# EAGLE design AB_ESP8266 (EAGLE 6.6.0)
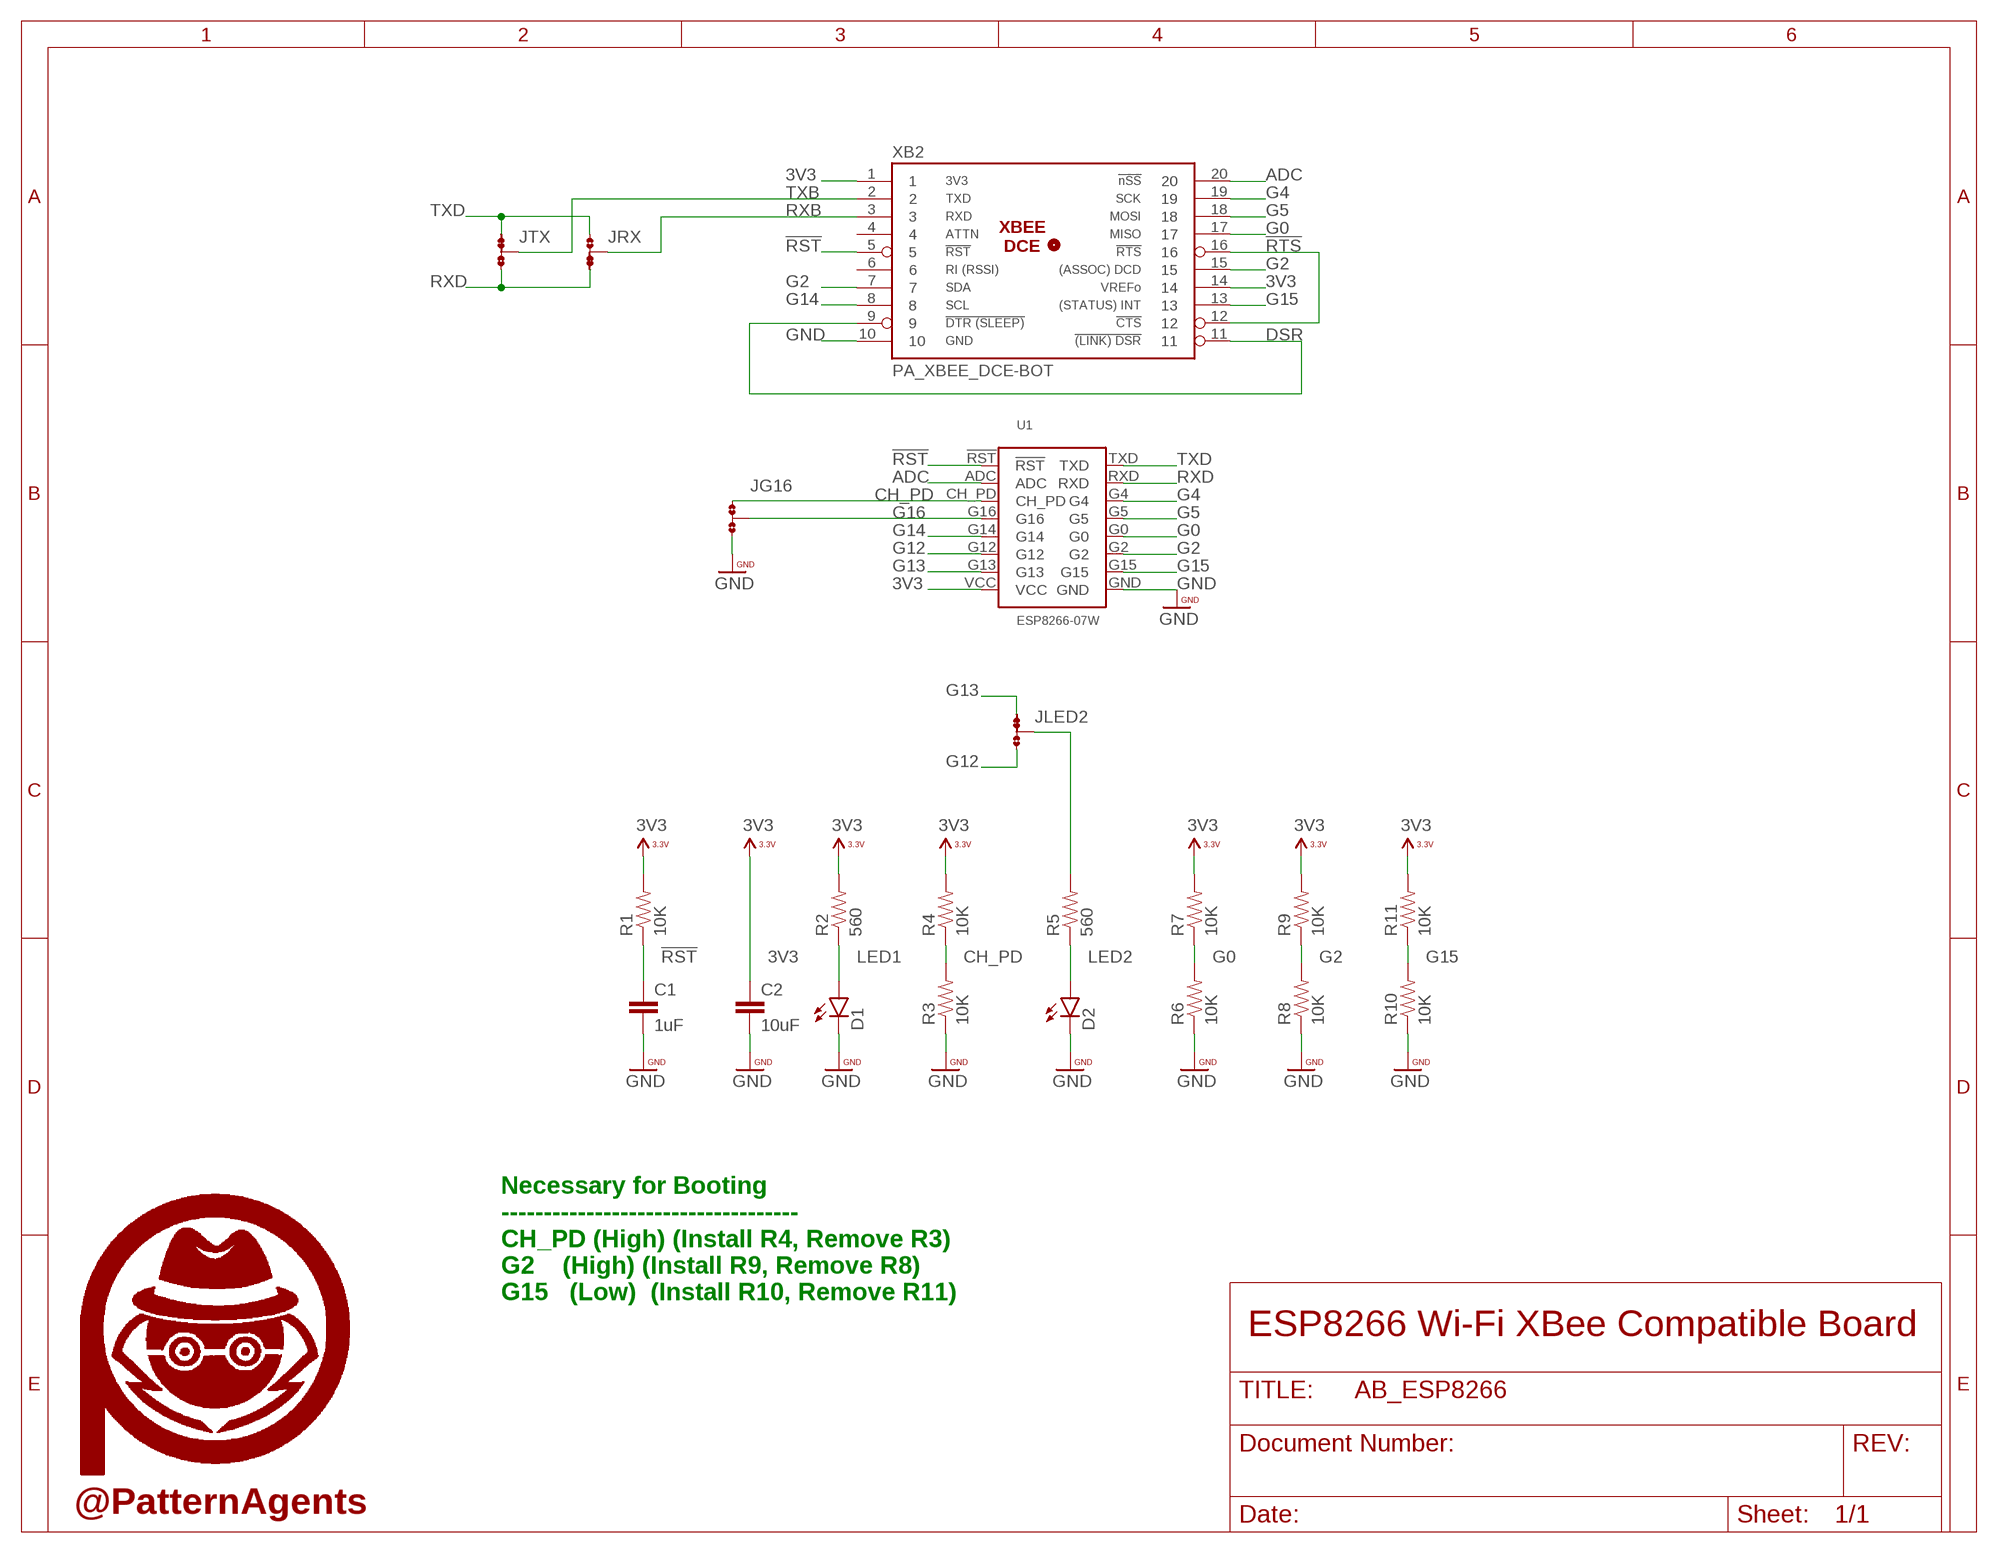
[diagram p0: schematic, sheet 1]

## Parts
C1  1uF  CAP0603-CAP  [0603-CAP]
C2  10uF  CAP0603-CAP  [0603-CAP]
D1  LED0603  [LED-0603]
D2  LED0603  [LED-0603]
JG16  JMP-3-NO  [JMP-3-NO]
JLED2  JMP-3-1_2  [JMP-3-1_2]
JRX  JMP-3-2_3  [JMP-3-2_3]
JTX  JMP-3-1_2  [JMP-3-1_2]
R1  10K  RESISTOR_SFE0603-RES  [0603-RES]
R2  560  RESISTOR_SFE0603-RES  [0603-RES]
R3  10K  RESISTOR_SFE0603-RES  [0603-RES]
R4  10K  RESISTOR_SFE0603-RES  [0603-RES]
R5  560  RESISTOR_SFE0603-RES  [0603-RES]
R6  10K  RESISTOR_SFE0603-RES  [0603-RES]
R7  10K  RESISTOR_SFE0603-RES  [0603-RES]
R8  10K  RESISTOR_SFE0603-RES  [0603-RES]
R9  10K  RESISTOR_SFE0603-RES  [0603-RES]
R10  10K  RESISTOR_SFE0603-RES  [0603-RES]
R11  10K  RESISTOR_SFE0603-RES  [0603-RES]
U1  ESP8266-07W  [ESP8266-07W]
U$18  PA_LOGO_SYMSMALL  [PA_LOGO_AGENT_SMALL_SYM]
U$19  PA_LOGO_SYMSMALL  [PA_LOGO_AGENT_SMALL_SYM]
XB2  PA_XBEE_DCE-BOT  [PA_XBEE_SMD_BOT]

## Nets
3V3: C2.1 R1.2 R2.2 R4.2 R7.2 R9.2 R11.2 U1.VCC XB2.1 XB2.14
!RST: C1.1 R1.1 U1.!RST XB2.5
!RTS: XB2.12 XB2.16
ADC: U1.ADC XB2.20
CH_PD: JG16.1 R3.2 R4.1 U1.CH_PD
DSR: XB2.9 XB2.11
G0: R6.2 R7.1 U1.G0 XB2.17
G2: R8.2 R9.1 U1.G2 XB2.7 XB2.15
G4: U1.G4 XB2.19
G5: U1.G5 XB2.18
G12: JLED2.3 U1.G12
G13: JLED2.1 U1.G13
G14: U1.G14 XB2.8
G15: R10.2 R11.1 U1.G15 XB2.13
G16: JG16.2 U1.G16
GND: C1.2 C2.2 D1.C D2.C JG16.3 R3.1 R6.1 R8.1 R10.1 U1.GND XB2.10
JLED2: JLED2.2 R5.2
LED1: D1.A R2.1
LED2: D2.A R5.1
RXB: JRX.2 XB2.3
RXD: JRX.3 JTX.3 U1.RXD
TXB: JTX.2 XB2.2
TXD: JRX.1 JTX.1 U1.TXD
Unconnected: XB2.4 XB2.6

## Notes on the sheet
- Necessary for Booting
  -----------------------------------
  CH_PD (High) (Install R4, Remove R3)
  G2    (High) (Install R9, Remove R8)
  G15   (Low)  (Install R10, Remove R11)
- ESP8266 Wi-Fi XBee Compatible Board
- @PatternAgents

## Library data of the parts
C1 C2 = moxdes_std:CAP: Capacitor Standard 0603 ceramic capacitor, and 0.1" leaded capacitor.
D1 D2 = SparkFun-LED:LED: LEDs Standard schematic elements and footprints for 5mm, 3mm, 1206, and 0603 sized LEDs. 5mm - Spark Fun Electronics SKU : COM-00529 (and others)
JG16 = PatternAgents-ProtoPads:JMP-3-NO: Three Terminal Jumper - Normally Open All Pads Open (unconnected) PatternAgents ProtoPads Library Schematic and PCB layout libraries for design patterns by PatternAgents. For the CADSoft Eagle CAD program : http://www.cadsoftusa.com/download-eagle/ Source LBR : http://www.patternagents.com Github : https://github.com/PatternAgents License : http://creativecommons.org/licenses/by-sa/4.0/ (Creative Commons 4.0) THIS SOFTWARE IS PROVIDED BY THE CONTRIBUTORS "AS IS" AND WITHOUT ANY EXPRESS OR IMPLIED WARRANTIES, INCLUDING, BUT NOT LIMITED TO, THE IMPLIED WARRANTIES OF MERCHANTABILITY AND FITNESS FOR A PARTICULAR PURPOSE ARE DISCLAIMED. IN NO EVENT SHALL THE COPYRIGHT OWNER OR CONTRIBUTORS BE LIABLE FOR ANY DIRECT, INDIRECT, INCIDENTAL, SPECIAL, EXEMPLARY, OR CONSEQUENTIAL DAMAGES (INCLUDING, BUT NOT LIMITED TO, PROCUREMENT OF SUBSTITUTE GOODS OR SERVICES; LOSS OF USE, DATA, OR PROFITS; OR BUSINESS INTERRUPTION) HOWEVER CAUSED AND ON ANY THEORY OF LIABILITY, WHETHER IN CONTRACT, STRICT LIABILITY, OR TORT (INCLUDING NEGLIGENCE OR OTHERWISE) ARISING IN ANY WAY OUT OF THE USE OF THIS SOFTWARE, EVEN IF ADVISED OF THE POSSIBILITY OF SUCH DAMAGE.; BOM: EXCLUDE
JLED2 JTX = PatternAgents-ProtoPads:JMP-3-1_2: Three Terminal Jumper - 1 & 2 Connected Positions 1and 2 are normally connected. PatternAgents ProtoPads Library Schematic and PCB layout libraries for design patterns by PatternAgents. For the CADSoft Eagle CAD program : http://www.cadsoftusa.com/download-eagle/ Source LBR : http://www.patternagents.com Github : https://github.com/PatternAgents License : http://creativecommons.org/licenses/by-sa/4.0/ (Creative Commons 4.0) THIS SOFTWARE IS PROVIDED BY THE CONTRIBUTORS "AS IS" AND WITHOUT ANY EXPRESS OR IMPLIED WARRANTIES, INCLUDING, BUT NOT LIMITED TO, THE IMPLIED WARRANTIES OF MERCHANTABILITY AND FITNESS FOR A PARTICULAR PURPOSE ARE DISCLAIMED. IN NO EVENT SHALL THE COPYRIGHT OWNER OR CONTRIBUTORS BE LIABLE FOR ANY DIRECT, INDIRECT, INCIDENTAL, SPECIAL, EXEMPLARY, OR CONSEQUENTIAL DAMAGES (INCLUDING, BUT NOT LIMITED TO, PROCUREMENT OF SUBSTITUTE GOODS OR SERVICES; LOSS OF USE, DATA, OR PROFITS; OR BUSINESS INTERRUPTION) HOWEVER CAUSED AND ON ANY THEORY OF LIABILITY, WHETHER IN CONTRACT, STRICT LIABILITY, OR TORT (INCLUDING NEGLIGENCE OR OTHERWISE) ARISING IN ANY WAY OUT OF THE USE OF THIS SOFTWARE, EVEN IF ADVISED OF THE POSSIBILITY OF SUCH DAMAGE.; BOM: EXCLUDE
JRX = PatternAgents-ProtoPads:JMP-3-2_3: Three Terminal Jumper - 2 & 3 Connected Positions 2 and 3 are normally connected. PatternAgents ProtoPads Library Schematic and PCB layout libraries for design patterns by PatternAgents. For the CADSoft Eagle CAD program : http://www.cadsoftusa.com/download-eagle/ Source LBR : http://www.patternagents.com Github : https://github.com/PatternAgents License : http://creativecommons.org/licenses/by-sa/4.0/ (Creative Commons 4.0) THIS SOFTWARE IS PROVIDED BY THE CONTRIBUTORS "AS IS" AND WITHOUT ANY EXPRESS OR IMPLIED WARRANTIES, INCLUDING, BUT NOT LIMITED TO, THE IMPLIED WARRANTIES OF MERCHANTABILITY AND FITNESS FOR A PARTICULAR PURPOSE ARE DISCLAIMED. IN NO EVENT SHALL THE COPYRIGHT OWNER OR CONTRIBUTORS BE LIABLE FOR ANY DIRECT, INDIRECT, INCIDENTAL, SPECIAL, EXEMPLARY, OR CONSEQUENTIAL DAMAGES (INCLUDING, BUT NOT LIMITED TO, PROCUREMENT OF SUBSTITUTE GOODS OR SERVICES; LOSS OF USE, DATA, OR PROFITS; OR BUSINESS INTERRUPTION) HOWEVER CAUSED AND ON ANY THEORY OF LIABILITY, WHETHER IN CONTRACT, STRICT LIABILITY, OR TORT (INCLUDING NEGLIGENCE OR OTHERWISE) ARISING IN ANY WAY OUT OF THE USE OF THIS SOFTWARE, EVEN IF ADVISED OF THE POSSIBILITY OF SUCH DAMAGE.; BOM: EXCLUDE
R1-R11 = moxdes_std:RESISTOR_SFE: Resistor Basic schematic elements and footprints for 0603, 1206, and PTH resistors.
U1 = scratch-ProtoPads:ESP8266: Pattern Agents ESP8266 (Type7 : 16 Pins) PatternAgents Prototyping/Pads Library Schematic & PCB Layout Symbols for Prototyping Boards. Pads in this library have been lengthened for hand soldering & prototyping. Schematic and PCB layout libraries for design patterns by PatternAgents. For the CADSoft Eagle CAD program : http://www.cadsoftusa.com/download-eagle/ Github : https://github.com/PatternAgents License : http://creativecommons.org/licenses/by-sa/4.0/ (Creative Commons 4.0) THIS SOFTWARE IS PROVIDED BY THE CONTRIBUTORS "AS IS" AND WITHOUT ANY EXPRESS OR IMPLIED WARRANTIES, INCLUDING, BUT NOT LIMITED TO, THE IMPLIED WARRANTIES OF MERCHANTABILITY AND FITNESS FOR A PARTICULAR PURPOSE ARE DISCLAIMED. IN NO EVENT SHALL THE COPYRIGHT OWNER OR CONTRIBUTORS BE LIABLE FOR ANY DIRECT, INDIRECT, INCIDENTAL, SPECIAL, EXEMPLARY, OR CONSEQUENTIAL DAMAGES (INCLUDING, BUT NOT LIMITED TO, PROCUREMENT OF SUBSTITUTE GOODS OR SERVICES; LOSS OF USE, DATA, OR PROFITS; OR BUSINESS INTERRUPTION) HOWEVER CAUSED AND ON ANY THEORY OF LIABILITY, WHETHER IN CONTRACT, STRICT LIABILITY, OR TORT (INCLUDING NEGLIGENCE OR OTHERWISE) ARISING IN ANY WAY OUT OF THE USE OF THIS SOFTWARE, EVEN IF ADVISED OF THE POSSIBILITY OF SUCH DAMAGE.
U$18 U$19 = PatternAgents-Logos:PA_LOGO_SYM: PatternAgents Logo Symbol Trademark : PatternAgents, LLC Github : https://github.com/PatternAgents/PCB_Libraries License : http://creativecommons.org/licenses/by-sa/3.0/ (Creative Commons 3.0) THIS SOFTWARE IS PROVIDED BY THE CONTRIBUTORS "AS IS" AND WITHOUT ANY EXPRESS OR IMPLIED WARRANTIES, INCLUDING, BUT NOT LIMITED TO, THE IMPLIED WARRANTIES OF MERCHANTABILITY AND FITNESS FOR A PARTICULAR PURPOSE ARE DISCLAIMED. IN NO EVENT SHALL THE COPYRIGHT OWNER OR CONTRIBUTORS BE LIABLE FOR ANY DIRECT, INDIRECT, INCIDENTAL, SPECIAL, EXEMPLARY, OR CONSEQUENTIAL DAMAGES (INCLUDING, BUT NOT LIMITED TO, PROCUREMENT OF SUBSTITUTE GOODS OR SERVICES; LOSS OF USE, DATA, OR PROFITS; OR BUSINESS INTERRUPTION) HOWEVER CAUSED AND ON ANY THEORY OF LIABILITY, WHETHER IN CONTRACT, STRICT LIABILITY, OR TORT (INCLUDING NEGLIGENCE OR OTHERWISE) ARISING IN ANY WAY OUT OF THE USE OF THIS SOFTWARE, EVEN IF ADVISED OF THE POSSIBILITY OF SUCH DAMAGE.
XB2 = PatternAgents-Interface:PA_XBEE_DCE: PatternAgents XBEE DCE (Data Commuication Equipment) Interface Pattern This is the Symbol for a "slave", such as a Zigbee, or Wi-Fi Radio module that plugs into a socket on an embedded PC. Pin Signal Direction 1 3V3 IN-POWER 2 TXD OUT 3 RXD IN 4 ATTN Open-Drain 5 RESET Open-Drain 6 RSSI (RI) OUT 7 I2C1_SDA Open_Drain 8 I2C1_SCL Open_Drain 9 DTR/Sleep IN 10 GND IN-POWER 11 LINK (DSR) OUT 12 CTS OUT 13 STATUS OUT 14 AREF IN-Analog Reference Voltage 15 ASSOS OUT 16 RTS IN 17 SPI1_MISO OUT 18 SPI1_MOSI IN 19 SPI1_SCK IN 20 SPI1_SS IN A corresponding "master" socket would be a DTE (Data Terminal Equipment) type. Source LBR : http://www.patternagents.com Github : https://github.com/patternagents License : http://creativecommons.org/licenses/by-sa/4.0/ (Creative Commons 4.0) THIS SOFTWARE IS PROVIDED BY THE CONTRIBUTORS "AS IS" AND WITHOUT ANY EXPRESS OR IMPLIED WARRANTIES, INCLUDING, BUT NOT LIMITED TO, THE IMPLIED WARRANTIES OF MERCHANTABILITY AND FITNESS FOR A PARTICULAR PURPOSE ARE DISCLAIMED. IN NO EVENT SHALL THE COPYRIGHT OWNER OR CONTRIBUTORS BE LIABLE FOR ANY DIRECT, INDIRECT, INCIDENTAL, SPECIAL, EXEMPLARY, OR CONSEQUENTIAL DAMAGES (INCLUDING, BUT NOT LIMITED TO, PROCUREMENT OF SUBSTITUTE GOODS OR SERVICES; LOSS OF USE, DATA, OR PROFITS; OR BUSINESS INTERRUPTION) HOWEVER CAUSED AND ON ANY THEORY OF LIABILITY, WHETHER IN CONTRACT, STRICT LIABILITY, OR TORT (INCLUDING NEGLIGENCE OR OTHERWISE) ARISING IN ANY WAY OUT OF THE USE OF THIS SOFTWARE, EVEN IF ADVISED OF THE POSSIBILITY OF SUCH DAMAGE.

## Board
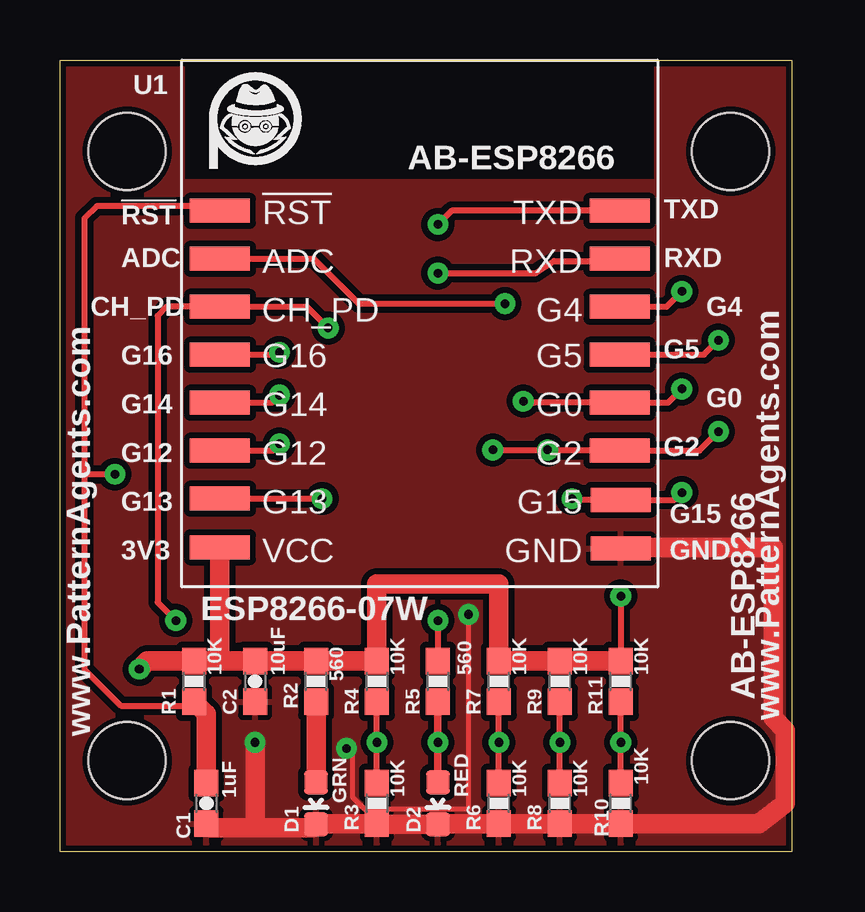
[diagram p1: board, top side]
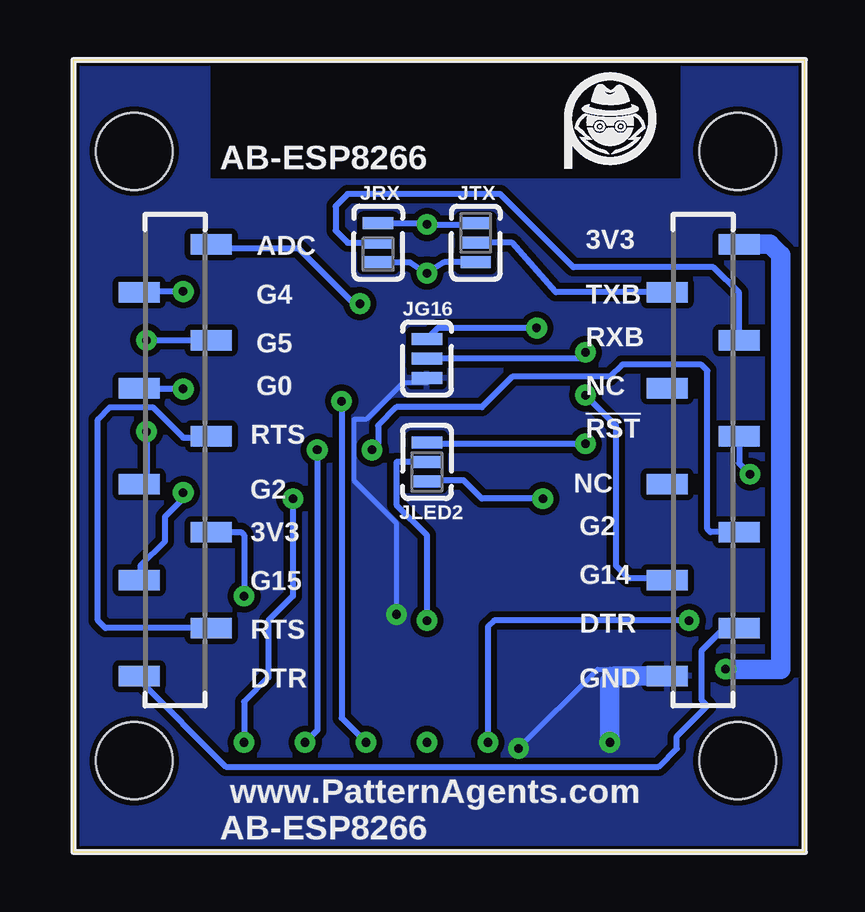
[diagram p2: board, bottom side, seen from below]

Size 30.48 x 33.02 mm. Coordinates in mm from the lower left corner, seen from the top.
Outline: 0,0 0,33.02 30.48,33.02 30.48,0 0,0
Copper layers (1*16): Top 0.035mm / dielectric 1.5mm / Bottom 0.035mm
Design rules "PatternAgents": minimum track width 8mil, minimum drill 14mil, track to track 8mil, track to pad 8mil, pad to pad 8mil, via to via 8mil, smd to smd 8mil, copper to edge 10mil, drill to drill 8mil, minimum pad ring 12mil, minimum via ring 10mil, stop-mask expansion 4mil, vias tented up to drill 25mil, thermal gap 8mil

### Footprints (pad centres in the part's own frame; a part is rotated, then mirrored left to right if it is on the bottom)
0603-CAP = smd 1.1 x 1: 1 -0.85,0; 2 0.85,0
LED-0603 = smd 1 x 1: A 0,-0.877; C 0,0.877
JMP-3-NO = smd 0.508 x 1.27: 1 -0.813,0; 2 0,0; 3 0.813,0
JMP-3-1_2 = smd 0.508 x 1.27: 1 -0.813,0; 2 0,0; 3 0.813,0
JMP-3-2_3 = smd 0.508 x 1.27: 1 -0.813,0; 2 0,0; 3 0.813,0
0603-RES = smd 1.1 x 1: 1 -0.85,0; 2 0.85,0
ESP8266-07W = smd 1 x 2.5: !RST 6.286,1.578; ADC 8.286,1.578; CH_PD 10.286,1.578; G0 14.286,18.242; G2 16.286,18.242; G4 10.286,18.242; G5 12.286,18.242; G12 16.286,1.578; G13 18.286,1.578; G14 14.286,1.578; G15 18.334,18.286; G16 12.286,1.578; GND 20.366,18.286; RXD 8.286,18.242; TXD 6.286,18.242; VCC 20.318,1.578
PA_XBEE_SMD_BOT = smd 0.85 x 1.7 bottom: 1 7.686,2.74; 2 9.686,5.74; 3 11.686,2.74; 4 13.686,5.74; 5 15.686,2.74; 6 17.686,5.74; 7 19.686,2.74; 8 21.686,5.74; 9 23.686,2.74; 10 25.686,5.74; 11 25.686,27.74; 12 23.686,24.74; 13 21.686,27.74; 14 19.686,24.74; 15 17.686,27.74; 16 15.686,24.74; 17 13.686,27.74; 18 11.686,24.74; 19 9.686,27.74; 20 7.686,24.74 | hole 3.2: 3.81,2.794; 29.21,2.794; 29.21,27.94; 3.81,27.94

### Placement (x,y rotation side)
C1  6.1,2.03 270 top
C2  8.13,7.11 270 top
D1  10.67,2.03 180 top
D2  15.75,2.03 180 top
JG16  15.75,20.57 270 bottom
JLED2  15.75,16.26 90 bottom
JRX  17.78,25.4 270 bottom
JTX  13.72,25.4 270 bottom
R1  5.59,7.11 90 top
R2  10.67,7.11 90 top
R3  13.21,2.03 90 top
R4  13.21,7.11 90 top
R5  15.75,7.11 90 top
R6  18.29,2.03 90 top
R7  18.29,7.11 90 top
R8  20.83,2.03 90 top
R9  20.83,7.11 90 top
R10  23.37,2.03 90 top
R11  23.37,7.11 90 top
U1  5.08,33.02 270 top
U$18  8.13,30.23 0 top
U$19  8.13,30.23 0 bottom
XB2  0,33.02 270 top

### Tracks (layer width: path | path; a pad name or v marks a point on that pad's centre or on a via)
3V3  (via drill 0.36)
  Top 0.254: v23.37,10.67 R11.2
  Top 0.813: R11.2 R9.2 R7.2 18.29,11.18 13.21,11.18 R4.2 R2.2 C2.1 6.6,7.96 | U1.VCC 6.66,8.01 6.6,7.96 | 6.6,7.96 R1.2 3.64,7.96 v3.3,7.62
  Bottom 0.254: XB2.14 23.49,13.33 23.37,13.21 v23.37,10.67
  Bottom 0.813: XB2.1 1.46,25.33 1.02,24.89 1.02,7.62 v3.3,7.62
!RST  (via drill 0.36)
  Top 0.254: U1.!RST 6.47,26.92 1.52,26.92 1.02,26.42 1.02,15.75 | R1.1 5.42,6.1 2.54,6.1 1.02,7.62 1.02,15.75 | v2.29,15.75 1.02,15.75
  Top 0.813: C1.1 6.1,5.75 R1.1
  Bottom 0.254: XB2.5 2.74,16.2 v2.29,15.75
!RTS
  Bottom 0.254: XB2.12 29.15,9.33 29.46,9.65 29.46,18.03 28.96,18.54 27.18,18.54 25.91,17.27 24.8,17.27 XB2.16
ADC  (via drill 0.36)
  Top 0.254: U1.ADC 10.57,24.73 12.45,22.86 v18.54,22.86
  Bottom 0.254: v18.54,22.86 18.8,22.86 21.08,25.15 24.55,25.15 XB2.20
CH_PD  (via drill 0.36)
  Top 0.254: R4.1 v13.21,4.57 R3.2 | v4.83,9.65 4.06,10.41 4.06,22.35 4.45,22.73 U1.CH_PD 10.29,22.73 v11.18,21.84
  Bottom 0.254: v4.83,9.65 12.95,9.65 13.21,9.4 v13.21,4.57 | v11.18,21.84 15.29,21.84 JG16.1
DSR
  Bottom 0.254: XB2.11 27.74,7.17 24.13,3.56 6.1,3.56 5.33,4.32 5.33,4.83 4.06,6.1 4.32,6.35 4.32,8.38 3.37,9.33 XB2.9
G0  (via drill 0.36)
  Top 0.254: v19.3,18.8 19.75,18.73 U1.G0 25.34,18.73 v25.91,19.3 | R7.1 v18.29,4.57 R6.2
  Bottom 0.254: v19.3,18.8 19.3,5.59 v18.29,4.57 | v25.91,19.3 27.71,19.3 XB2.17
G2  (via drill 0.36)
  Top 0.254: R9.1 v20.83,4.57 R8.2 | v27.43,17.53 26.64,16.73 U1.G2 20.35,16.73 v20.32,16.76 v18.03,16.76
  Bottom 0.254: v20.32,16.76 20.32,5.08 v20.83,4.57 | v27.43,17.53 27.43,15.64 XB2.15 | XB2.7 3.94,13.33 4.06,13.46 4.06,20.07 4.32,20.32 7.62,20.32 8.13,19.81 12.19,19.81 13.46,18.54 17.02,18.54 17.78,17.78 17.78,17.02 v18.03,16.76
G4  (via drill 0.36)
  Top 0.254: U1.G4 25.27,22.73 v25.91,23.37
  Bottom 0.254: v25.91,23.37 27.71,23.37 XB2.19
G5  (via drill 0.36)
  Top 0.254: U1.G5 26.83,20.73 v27.43,21.34
  Bottom 0.254: v27.43,21.34 XB2.18
G12  (via drill 0.36)
  Top 0.254: U1.G12 8.86,16.73 v9.14,17.02
  Bottom 0.254: v9.14,17.02 15.7,17.02 JLED2.3
G13  (via drill 0.36)
  Top 0.254: U1.G13 v10.92,14.73
  Bottom 0.254: v10.92,14.73 13.46,14.73 14.22,15.49 15.7,15.49 JLED2.1
G14  (via drill 0.36)
  Top 0.254: U1.G14 8.83,18.73 v9.14,19.05
  Bottom 0.254: v9.14,19.05 7.87,17.78 7.87,11.94 7.37,11.43 5.84,11.43 XB2.8
G15  (via drill 0.36)
  Top 0.254: v21.34,14.73 21.38,14.69 U1.G15 25.61,14.69 v25.91,14.99 | R11.1 v23.37,4.57 R10.2
  Bottom 0.254: v21.34,14.73 21.34,10.67 22.35,9.65 22.35,7.28 R11.1 v23.37,4.57 | v25.91,14.99 25.91,14.73 26.67,13.97 26.67,12.95 27.69,11.94 27.69,11.39 XB2.13
G16  (via drill 0.36)
  Top 0.254: U1.G16 9.05,20.73 v9.14,20.83
  Bottom 0.254: v9.14,20.83 9.4,20.57 JG16.2
GND  (via drill 0.36)
  Top 0.203: v11.94,4.32 12.19,4.06 12.19,2.29 12.7,1.78 17.02,1.78 v17.02,9.91 | 13.46,1.27 R3.1
  Top 0.813: v8.13,4.57 8.13,1.02 | 8.13,1.02 10.53,1.02 | 10.7,1.18 R3.1 13.23,1.16 D2.C 15.78,1.18 R6.1 R8.1 R10.1 29.12,1.18 30.23,2.03 30.23,5.08 29.72,5.59 29.72,12.7 23.41,12.7 | 8.13,1.02 6.26,1.02 C1.2
  Bottom 0.203: v11.94,4.32 8.64,7.62 8.13,7.62 7.91,7.33 | v17.02,9.91 17.02,13.72 18.8,15.49 18.8,18.03 18.29,18.03 16.76,19.56 15.75,19.56 JG16.3
  Bottom 0.813: XB2.10 7.91,7.33 8.13,7.11 v8.13,4.57
  pour Top (isolate 0.254, rank 2): 0,33.02 5.08,33.02 5.08,27.94 24.89,27.94 24.89,33.02 30.48,33.02 30.48,0 0,0
  pour Bottom (isolate 0.254, rank 2): 0,33.02 5.08,33.02 5.08,27.94 24.89,27.94 24.89,33.02 30.48,33.02 30.48,0 0,0
JLED2  (via drill 0.36)
  Top 0.254: v15.75,9.65 R5.2
  Bottom 0.254: JLED2.2 17.02,16.26 17.02,14.48 15.75,13.21 v15.75,9.65
LED1
  Top 0.813: D1.A R2.1
LED2  (via drill 0.36)
  Top 0.305: R5.1 v15.75,4.57 D2.A
RXB
  Bottom 0.254: XB2.3 2.74,23.31 3.81,24.38 9.65,24.38 12.7,27.43 19.05,27.43 19.56,26.92 19.56,25.91 19.05,25.4 JRX.2
RXD  (via drill 0.36)
  Top 0.254: v15.75,24.13 19.81,24.13 20.57,24.64 23.23,24.64 U1.RXD
  Bottom 0.254: JTX.3 15.04,24.59 v15.75,24.13 16.46,24.59 JRX.3
TXB
  Bottom 0.254: XB2.2 10.38,23.33 12.19,25.4 JTX.2
TXD  (via drill 0.36)
  Top 0.254: U1.TXD 16.32,26.73 v15.75,26.16
  Bottom 0.254: JTX.1 13.77,26.16 v15.75,26.16 15.8,26.21 JRX.1

### Text on the board
tPlace: AB-ESP8266 | !RST | TXD | ADC | RXD | www.PatternAgents.com | CH_PD | G4 | G5 | G16 | G0 | G14 | G2 | G12 | G13 | G15 | 3V3 | GND | AB-ESP8266 | www.PatternAgents.com | GRN | RED
bPlace: AB-ESP8266 | 3V3 | ADC | TXB | G4 | RXB | G5 | NC | G0 | !RST | RTS | NC | G2 | G2 | 3V3 | G14 | G15 | DTR | RTS | GND | DTR | www.PatternAgents.com | AB-ESP8266